# Altium schematic sheet Microcontroller Schematic.SchDoc: Microcontroller Schematic
size B; Date: 1/7/2022; Author: Dennis Slobodzian; DrawnBy: Dennis Slobodzian; Engineer: Dennis Slobodzian; Revision: 0.0; SheetNumber: 1; SheetTotal: 3
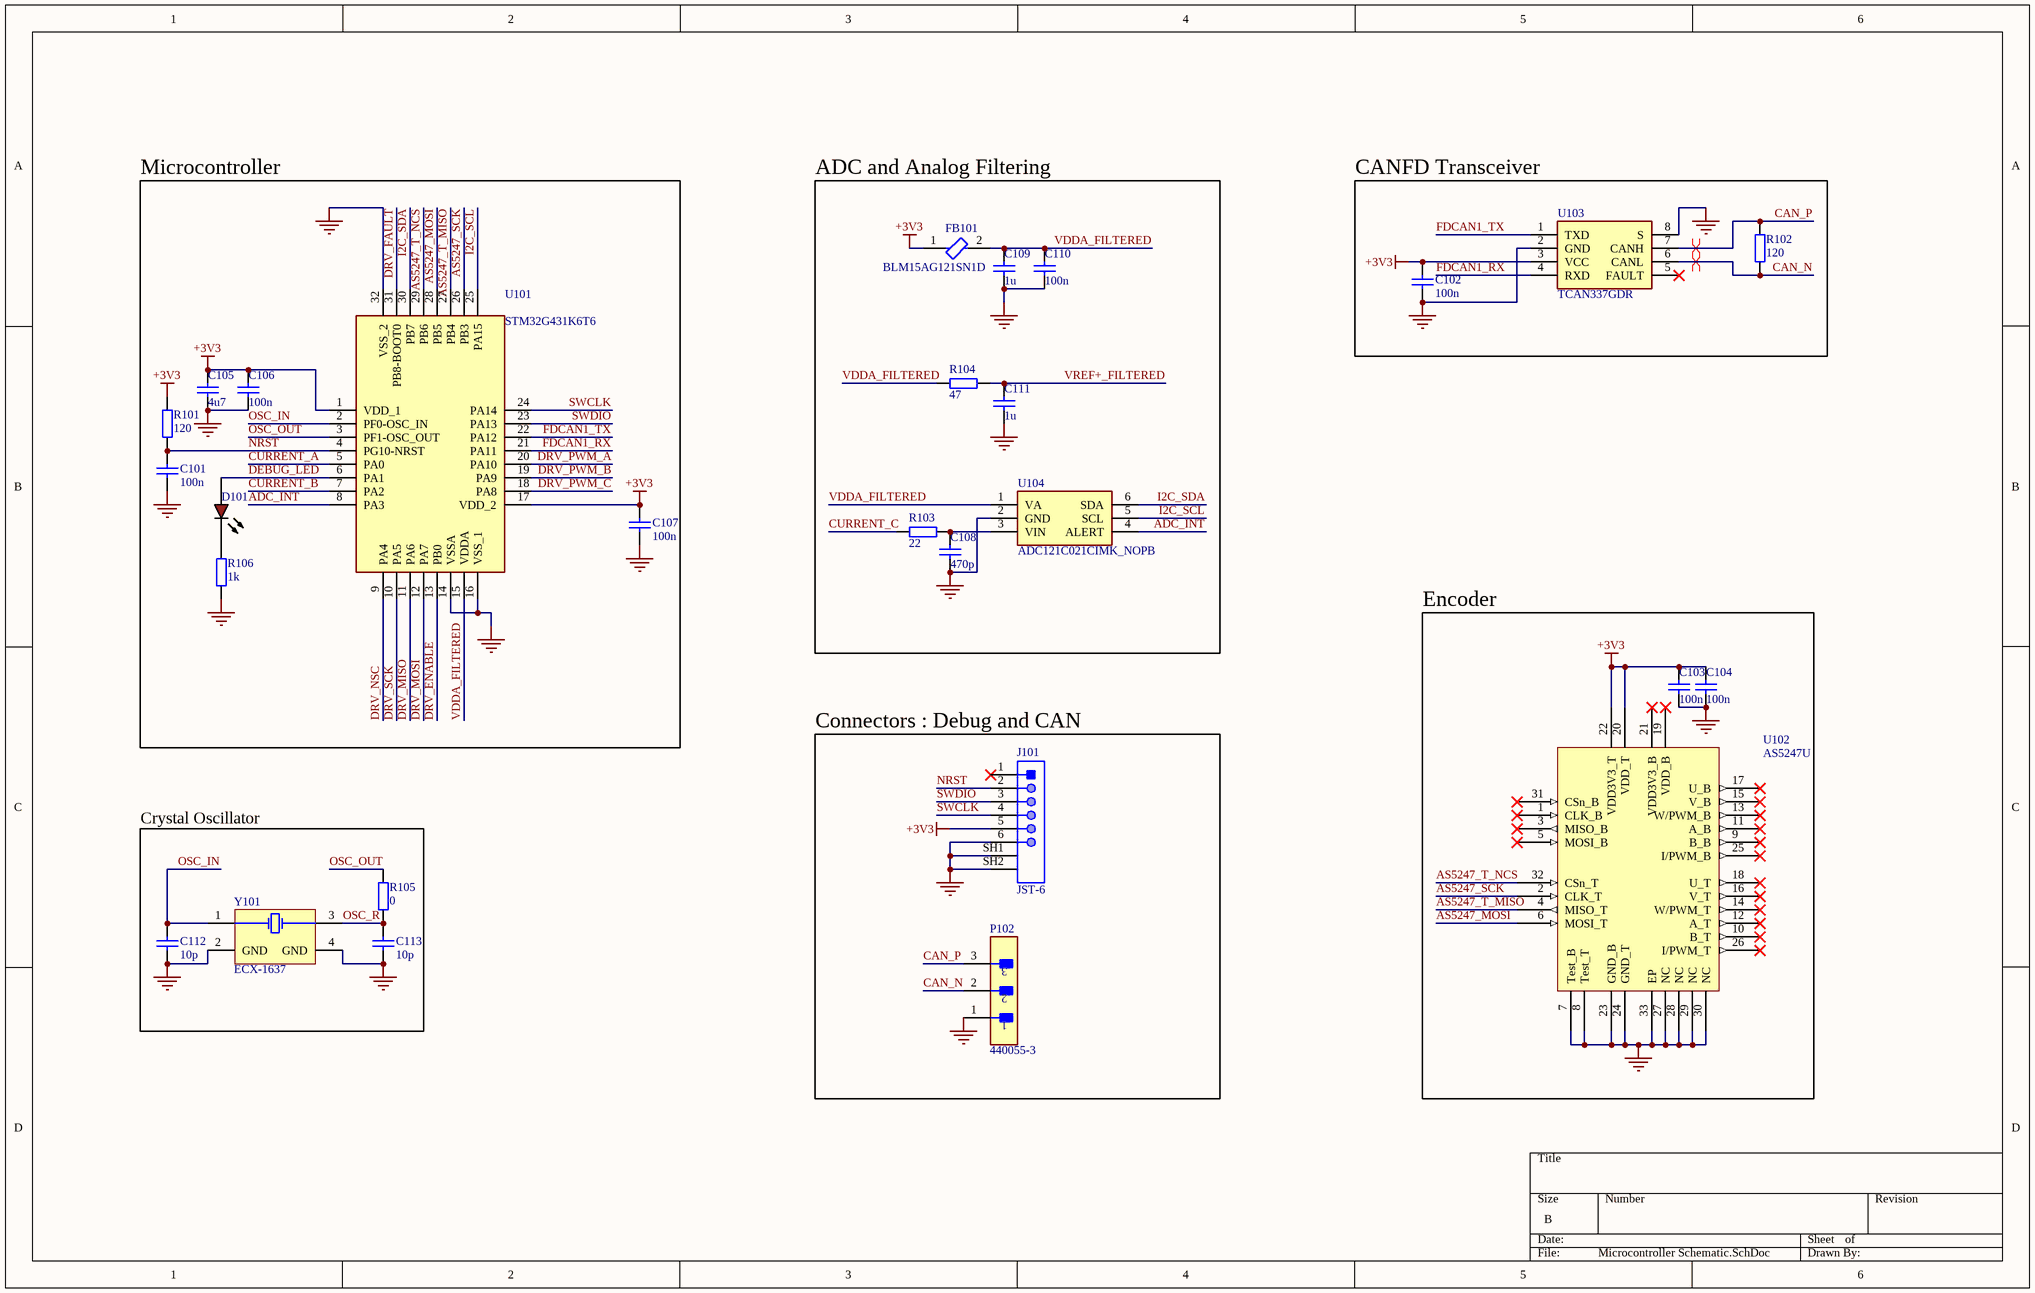
[diagram p0: Microcontroller Schematic.SchDoc]

## Parts
C101  100n  [CAPC1005X55N]
C102  100n  [CAPC1005X55N]
C103  100n  [CAPC1005X55N]
C104  100n  [CAPC1005X55N]
C105  4u7  [CAPC1608X90N]
C106  100n  [CAPC1005X55N]
C107  100n  [CAPC1005X55N]
C108  470p  [CAPC1005X55N]
C109  1u  [CAPC1005X55N]
C110  100n  [CAPC1005X55N]
C111  1u  [CAPC1005X55N]
C112  10p  [CAPC1005X55N]
C113  10p  [CAPC1005X55N]
D101  RED  [150040GS73220]  (value not drawn)
FB101  BLM15AG121SN1D  [FP-BLM15-0_05-MFG]
J101  JST-6  [JST_S6B-ZR-SM4A-TF(LF)(SN)]
P102  440055-3  [FP-440055-3-MFG]
R101  120  [RESC1005X40N]
R102  120  [RESC1005X40N]
R103  22  [RESC1005X40N]
R104  47  [RESC1005X40N]
R105  0  [RESC1005X40N]
R106  1k  [RESC1005X40N]
U101  STM32G431K6T6  [QFP80P900X900X160-32N]
U102  AS5247U  [QFN-N32-THM]
U103  TCAN337GDR  [SOIC127P600X175-8N]
U104  ADC121C021CIMK_NOPB  [SOT95P280X110-6N]
Y101  ECX-1637  [ECX-1637]

## Blocks framed on the sheet
Microcontroller: C101 C105-C107 D101 R101 R106 U101
ADC and Analog Filtering: C108-C111 FB101 R103 R104 U104
CANFD Transceiver: C102 R102 U103
Encoder: C103 C104 U102
Connectors : Debug and CAN: J101 P102
Crystal Oscillator: C112 C113 R105 Y101

## Nets
+3V3: C102.2 C103.2 C104.2 C105.1 C106.2 C107.2 FB101.1 J101.5 R101.1 U101.1(VDD_1) U101.17(VDD_2) U102.20(VDD_T) U102.22(VDD3V3_T) U103.3(VCC)
GND: C101.2 C102.1 C103.1 C104.1 C105.2 C106.1 C107.1 C108.1 C109.1 C110.1 C111.1 C112.1 C113.1 J101.6 J101.SH1 J101.SH2 P102.1 R106.2 U101.14(VSSA) U101.16(VSS_1) U101.32(VSS_2) U102.7(Test_B) U102.8(Test_T) U102.23(GND_B) U102.24(GND_T) U102.27(NC) U102.28(NC) U102.29(NC) U102.30(NC) U102.33(EP) U103.2(GND) U103.8(S) U104.2(GND) Y101.2(GND) Y101.4(GND)
ADC_INT: U101.8(PA3) U104.4(ALERT)
AS5247_MOSI: U101.28(PB5) U102.6(MOSI_T)
AS5247_SCK: U101.26(PB3) U102.2(CLK_T)
AS5247_T_MISO: U101.27(PB4) U102.4(MISO_T)
AS5247_T_NCS: U101.29(PB6) U102.32(CSn_T)
CAN_N: P102.2 R102.1 U103.6(CANL)
CAN_P: P102.3 R102.2 U103.7(CANH)
CURRENT_A: U101.5(PA0)
CURRENT_B: U101.7(PA2)
CURRENT_C: R103.1
DEBUG_LED: D101.1(A) U101.6(PA1)
DRV_ENABLE: U101.13(PB0)
DRV_FAULT: U101.31(PB8-BOOT0)
DRV_MISO: U101.11(PA6)
DRV_MOSI: U101.12(PA7)
DRV_NSC: U101.9(PA4)
DRV_PWM_A: U101.20(PA10)
DRV_PWM_B: U101.19(PA9)
DRV_PWM_C: U101.18(PA8)
DRV_SCK: U101.10(PA5)
FDCAN1_RX: U101.21(PA11) U103.4(RXD)
FDCAN1_TX: U101.22(PA12) U103.1(TXD)
I2C_SCL: U101.25(PA15) U104.5(SCL)
I2C_SDA: U101.30(PB7) U104.6(SDA)
NRST: C101.1 J101.2 R101.2 U101.4(PG10-NRST)
OSC_IN: C112.2 U101.2(PF0-OSC_IN) Y101.1(X1)
OSC_OUT: R105.1 U101.3(PF1-OSC_OUT)
OSC_R: C113.2 R105.2 Y101.3(X2)
SWCLK: J101.4 U101.24(PA14)
SWDIO: J101.3 U101.23(PA13)
VDDA_FILTERED: C109.2 C110.2 FB101.2 R104.1 U101.15(VDDA) U104.1(VA)
VREF+_FILTERED: C111.2 R104.2
NetC108_2: C108.2 R103.2 U104.3(VIN)
NetD101_2: D101.2(K) R106.1

Not connected (* = marked no-connect by the designer): J101 1*; U102 1(CLK_B)* 3(MISO_B)* 5(MOSI_B)* 9(B_B)* 10(B_T)* 11(A_B)* 12(A_T)* 13(W/PWM_B)* 14(W/PWM_T)* 15(V_B)* 16(V_T)* 17(U_B)* 18(U_T)* 19(VDD_B)* 21(VDD3V3_B)* 25(I/PWM_B)* 26(I/PWM_T)* 31(CSn_B)*; U103 5(FAULT)*

## Layout directives
differential pair: CAN_N, CAN_P

## Library data of the parts
C101-C104 C106-C113 = CAP_0402_16V: Capacitor; Manufacturer_Name: Samsung Electro-Mechanics; Manufacturer_Part_Number: CL05B104KO5NNNC; Datasheet Link: https://datasheet.datasheetarchive.com/originals/distributors/Datasheets-DGA10/2408147.pdf; Height: 0.55mm; Mouser Part Number: 187-CL05B104KO5NNNC; Mouser Price/Stock: https://www.mouser.co.uk/ProductDetail/Samsung-Electro-Mechanics/CL05B104KO5NNNC?qs=hqM3L16%252BxlfT2SKOuAUq6Q%3D%3D; Arrow Part Number: CL05B104KO5NNNC; Arrow Price/Stock: https://www.arrow.com/en/products/cl05b104ko5nnnc/samsung-electro-mechanics
C105 = CAP_0603_16V: Capacitor; Manufacturer_Name: Samsung Electro-Mechanics; Manufacturer_Part_Number: CL05B104KO5NNNC; Datasheet Link: https://datasheet.datasheetarchive.com/originals/distributors/Datasheets-DGA10/2408147.pdf; Height: 0.55mm; Mouser Part Number: 187-CL05B104KO5NNNC; Mouser Price/Stock: https://www.mouser.co.uk/ProductDetail/Samsung-Electro-Mechanics/CL05B104KO5NNNC?qs=hqM3L16%252BxlfT2SKOuAUq6Q%3D%3D; Arrow Part Number: CL05B104KO5NNNC; Arrow Price/Stock: https://www.arrow.com/en/products/cl05b104ko5nnnc/samsung-electro-mechanics
D101 = RED_0402_LED
FB101 = CMP-0686-00170-4: Chip Ferrite Bead, 0402, 120Ω @ 100MHz, 0.19Ω, 25%, 550mA; Material: Steel; Max DC Current: 500mA; Shielding: Unshielded; Number of Lines: 1; DC Resistance (DCR): 190mR; Impedance: 120R; Packaging: Tape and Reel; Core Material: Ferrite; Number of Pins: 2; Tolerance: 25%; Case Code (Imperial): 0402; DC Current: 500mA; Termination: SMD/SMT; Height: 0.5mm; REACH SVHC: No SVHC; Max Operating Temperature: 125°C; Case Code (Metric): 1005; Length: 1mm; Test Frequency: 100MHz; Lead Free: Lead Free; Depth: 0.55mm; Max Current Rating: 550mA; Case/Package: 0402; Min Operating Temperature: -55°C; Width: 0.5mm; Military Standard: Not; Frequency: 100MHz; Current Rating: 550mA; Package Quantity: 1; Number of Circuits: 1; Radiation Hardening: No
P102 = CMP-03369-000061-1: CONN HEADER R/A 3POS 2MM; Manufacturer: TE Connectivity; Voltage Rating: 250V; Conn Orientation: Right Angle; Current Rating: 3A; Number Of Contacts: 3; Conn Gender: Male; Height: 5.25mm; Automotive: No; Manufacturer Part Number: 440055-3; Temperature: -25°C to +85°C; Pitch: 2mm; Category: Conn; Device Class L1: Connectors; ComponentLink2Description: Datasheet; Footprint Url: https://www.te.com/commerce/DocumentDelivery/DDEController?Action=showdoc&DocId=Customer+Drawing%7F440055%7FB4%7Fpdf%7FEnglish%7FENG_CD_440055_B4.pdf%7F440055-3; Package: 440055-3; ComponentLink2URL: https://www.te.com/usa-en/product-440055-3.datasheet.pdf; Number Of Rows: 1; Octopart: https://octopart.com/440055-3-te+connectivity-40644627; Mouser Description: Headers & Wire Housings 3 POS HDR R/A 2.0mm; Digikey Description: CONN HEADER R/A 3POS 2MM; Device Class L2: Headers and Wire Housings; Lead Free: Yes; Temperature Range High: +85°C; RoHS: TRUE; Temperature Range Low: -25°C; Contact Material: Tin; Device Class L3: unset
R101-R106 = RES_0402
U102 = AS5247U: ams AS5247U Magnetic Rotary Position Sensor; ComponentLink1Description: New link; ComponentLink1URL: *; ComponentLink2Description: New link 1; ComponentLink2URL: *
U103 = TCAN337GDR: Integrated Circuit; Manufacturer_Name: Texas Instruments; Datasheet Link: http://www.ti.com/lit/gpn/tcan337g; Height: 1.75mm; Manufacturer_Part_Number: TCAN337GDR; Mouser Part Number: 595-TCAN337GDR; Mouser Price/Stock: https://www.mouser.co.uk/ProductDetail/Texas-Instruments/TCAN337GDR?qs=gMfM3zrbS4qJ%252BEWbPaeUtA%3D%3D; Arrow Part Number: TCAN337GDR; Arrow Price/Stock: https://www.arrow.com/en/products/tcan337gdr/texas-instruments?region=nac
U104 = ADC121C021CIMK_NOPB: Integrated Circuit; Manufacturer_Name: Texas Instruments; Manufacturer_Part_Number: ADC121C021CIMK/NOPB; Datasheet Link: http://www.ti.com/lit/ds/symlink/adc121c021.pdf; Height: 1.1mm; Mouser Part Number: 926-AD121C021CIMKNPB; Mouser Price/Stock: https://www.mouser.co.uk/ProductDetail/Texas-Instruments/ADC121C021CIMK-NOPB?qs=7X5t%252BdzoRHCpyBc1ZtMoSA%3D%3D; Arrow Part Number: ADC121C021CIMK/NOPB; Arrow Price/Stock: https://www.arrow.com/en/products/adc121c021cimknopb/texas-instruments